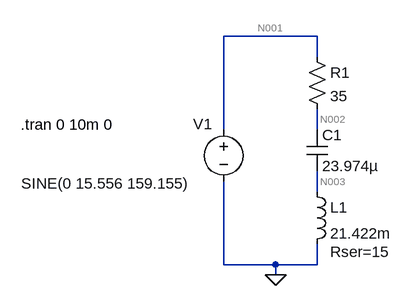
[diagram p0: schematic 1_6.asc]
1_6.asc, the LTspice schematic file:
Version 4.1
SHEET 1 880 680
WIRE 320 -64 176 -64
WIRE 320 -32 320 -64
WIRE 176 80 176 -64
WIRE 320 80 320 48
WIRE 320 176 320 144
WIRE 176 288 176 160
WIRE 256 288 176 288
WIRE 320 288 320 256
WIRE 320 288 256 288
WIRE 256 304 256 288
FLAG 256 304 0
SYMBOL voltage 176 64 R0
WINDOW 123 0 0 Left 0
WINDOW 39 24 124 Left 2
WINDOW 0 -47 7 Left 2
WINDOW 3 -311 99 Left 2
SYMATTR InstName V1
SYMATTR Value SINE(0 15.556 159.155)
SYMBOL res 304 -48 R0
SYMATTR InstName R1
SYMATTR Value 35
SYMBOL cap 304 80 R0
SYMATTR InstName C1
SYMATTR Value 23.974µ
SYMBOL ind 304 160 R0
WINDOW 39 36 108 Left 2
SYMATTR SpiceLine Rser=15
SYMATTR InstName L1
SYMATTR Value 21.422m
TEXT -136 72 Left 2 !.tran 0 10m 0

The netlist it stands for:
* 1_6.asc
V1 N001 0 SINE(0 15.556 159.155)
R1 N001 N002 35
C1 N002 N003 23.974µ
L1 N003 0 21.422m Rser=15
.tran 0 10m 0
.backanno
.end

* Results of the author's LTspice run, read from the files saved beside the schematic
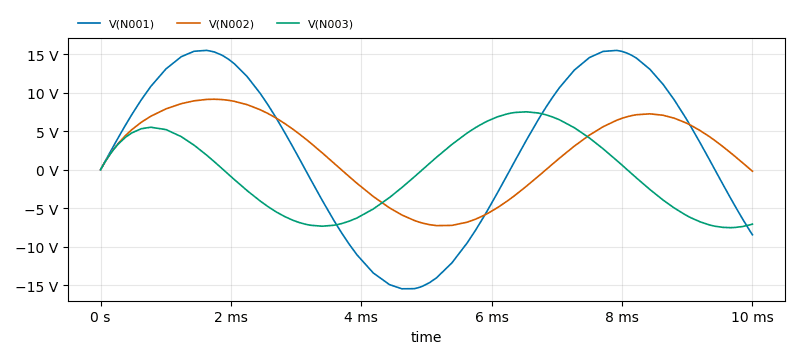
[diagram p1: Transient Analysis of 1_6.asc, plotted from the saved traces]
* Transient Analysis, 1 run:
*   V(N001): min -15.49 V, max 15.53 V, average 2.854 V, rms 10.74 V, last -8.463 V
*   V(N002): min -7.271 V, max 9.171 V, average 2.28 V, rms 5.798 V, last -192.8 mV
*   V(N003): min -7.538 V, max 7.533 V, average -261.5 mV, rms 5.148 V, last -7.083 V